# Altium schematic sheet BUS.SchDoc
size A4; SheetNumber: 8; SheetTotal: 15
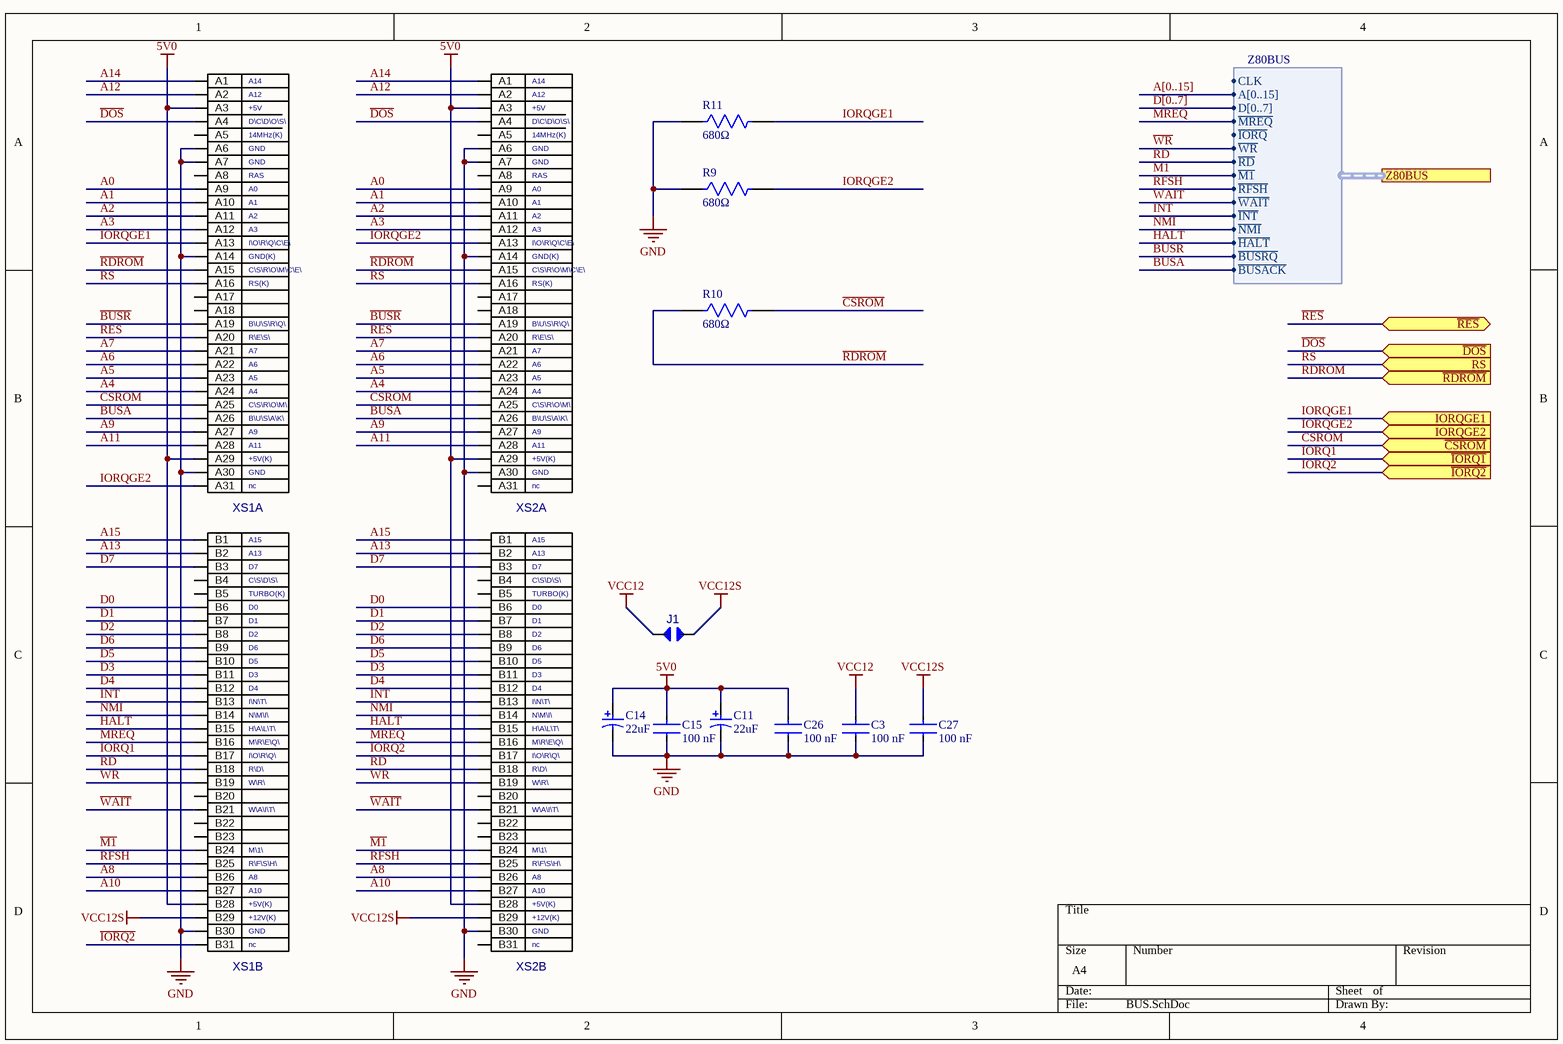
[diagram p0: BUS.SchDoc]

## Parts
C3  Capacitance: 100 nF  [FP-CC0805-0_85-IPC_A]  (hidden comment: CC0805KRX7R9BB104)
C11  Capacitance: 22uF  [AVX-TAJ-B-2_M]  (hidden comment: TAJB226K016RNJ)
C14  Capacitance: 22uF  [AVX-TAJ-B-2_M]  (hidden comment: TAJB226K016RNJ)
C15  Capacitance: 100 nF  [FP-CC0805-0_85-IPC_A]  (hidden comment: CC0805KRX7R9BB104)
C26  Capacitance: 100 nF  [FP-CC0805-0_85-IPC_A]  (hidden comment: CC0805KRX7R9BB104)
C27  Capacitance: 100 nF  [FP-CC0805-0_85-IPC_A]  (hidden comment: CC0805KRX7R9BB104)
J1  JUMPER  [JUMPER_JUMPER(Primary)]  (value not drawn)
R9  value 680Ω  [FP-RT0805-IPC_A]  (hidden comment: RT0805FRE07680RL)
R10  value 680Ω  [FP-RT0805-IPC_A]  (hidden comment: RT0805FRE07680RL)
R11  value 680Ω  [FP-RT0805-IPC_A]  (hidden comment: RT0805FRE07680RL)
XS1  ZXSLOT  [SLOT62_ZXSLOT(Primary)]  (value not drawn)  (parts A,B of 2)
XS2  ZXSLOT  [SLOT62_ZXSLOT(Primary)]  (value not drawn)  (parts A,B of 2)

## Ports
IORQGE1 (in), IORQGE2 (in), RS (in), Z80BUS (harness Z80BUS), ~{CSROM} (in), ~{DOS} (in), ~{IORQ1} (in), ~{IORQ2} (in), ~{RDROM} (in), ~{RES} (bidir)

## Harnesses
Z80BUS: A[0..15], D[0..7], ~{MREQ}, ~{IORQ}, ~{WR}, ~{RD}, ~{M1}, ~{RFSH}, ~{WAIT}, ~{INT}, ~{NMI}, ~{HALT}, ~{BUSRQ}, ~{BUSACK}, CLK

## Nets
5V0: C11.1 C14.1 C15.1 C26.1 XS1.A3 XS1.A29 XS1.B28 XS2.A3 XS2.A29 XS2.B28
GND: C3.2 C11.2 C14.2 C15.2 C26.2 C27.2 R9.1 R11.1 XS1.A6 XS1.A7 XS1.A14 XS1.A30 XS1.B30 XS2.A6 XS2.A7 XS2.A14 XS2.A30 XS2.B30
VCC12: C3.1 J1.0
VCC12S: C27.1 J1.1 XS1.B29 XS2.B29
A0: XS1.A9 XS2.A9
A1: XS1.A10 XS2.A10
A2: XS1.A11 XS2.A11
A3: XS1.A12 XS2.A12
A4: XS1.A24 XS2.A24
A5: XS1.A23 XS2.A23
A6: XS1.A22 XS2.A22
A7: XS1.A21 XS2.A21
A8: XS1.B26 XS2.B26
A9: XS1.A27 XS2.A27
A10: XS1.B27 XS2.B27
A11: XS1.A28 XS2.A28
A12: XS1.A2 XS2.A2
A13: XS1.B2 XS2.B2
A14: XS1.A1 XS2.A1
A15: XS1.B1 XS2.B1
~{BUSA}: XS1.A26 XS2.A26 ; port Z80BUS.~{BUSACK}
~{BUSR}: XS1.A19 XS2.A19 ; port Z80BUS.~{BUSRQ}
~{CSROM}: R10.2 XS1.A25 XS2.A25 ; port ~{CSROM}
D0: XS1.B6 XS2.B6
D1: XS1.B7 XS2.B7
D2: XS1.B8 XS2.B8
D3: XS1.B11 XS2.B11
D4: XS1.B12 XS2.B12
D5: XS1.B10 XS2.B10
D6: XS1.B9 XS2.B9
D7: XS1.B3 XS2.B3
~{DOS}: XS1.A4 XS2.A4 ; port ~{DOS}
~{HALT}: XS1.B15 XS2.B15 ; port Z80BUS.~{HALT}
~{INT}: XS1.B13 XS2.B13 ; port Z80BUS.~{INT}
~{IORQ1}: XS1.B17 ; port ~{IORQ1}
~{IORQ2}: XS1.B31 XS2.B17 ; port ~{IORQ2}
IORQGE1: R11.2 XS1.A13 ; port IORQGE1
IORQGE2: R9.2 XS1.A31 XS2.A13 ; port IORQGE2
~{M1}: XS1.B24 XS2.B24 ; port Z80BUS.~{M1}
~{MREQ}: XS1.B16 XS2.B16 ; port Z80BUS.~{MREQ}
~{NMI}: XS1.B14 XS2.B14 ; port Z80BUS.~{NMI}
~{RD}: XS1.B18 XS2.B18 ; port Z80BUS.~{RD}
~{RDROM}: R10.1 XS1.A15 XS2.A15 ; port ~{RDROM}
~{RES}: XS1.A20 XS2.A20 ; port ~{RES}
~{RFSH}: XS1.B25 XS2.B25 ; port Z80BUS.~{RFSH}
RS: XS1.A16 XS2.A16 ; port RS
~{WAIT}: XS1.B21 XS2.B21 ; port Z80BUS.~{WAIT}
~{WR}: XS1.B19 XS2.B19 ; port Z80BUS.~{WR}

Not connected (* = marked no-connect by the designer): XS1 A5 A8 A17 A18 B4 B5 B20 B22 B23; XS2 A5 A8 A17 A18 A31 B4 B5 B20 B22 B23 B31

## Buses and harness runs
bus A[0..15]
bus D[0..7]

## Notes on the sheet
- (in symbol ZXSLOT, part A) +5V; D\C\D\O\S\; 14MHz(K); GND; RAS; A0; I\O\R\Q\C\E\; GND(K); C\S\R\O\M\C\E\; RS(K); B\U\S\R\Q\; R\E\S\; C\S\R\O\M\; B\U\S\A\K\; +5V(K); nc
- (in symbol ZXSLOT, part B) D7; C\S\D\S\; TURBO(K); D0; D1; D2; D6; D5; D3; D4; I\N\T\; N\M\I\; H\A\L\T\; M\R\E\Q\; I\O\R\Q\; R\D\; W\R\; W\A\I\T\; M\1\; R\F\S\H\; +5V(K); +12V(K); GND; nc

## Library data of the parts
C3 C15 C26 C27 = CMP-2100-03606-3: CAP CER 0.1UF 50V X7R 0805; Manufacturer: Yageo; Value: 100 nF; Manufacturer Part Number: CC0805KRX7R9BB104; Category: Cap; Case/Package: 0805
C11 C14 = CMP-2100-03689-1: Standard Tantalum, 22 uF, +/- 10%, 16 V, -55 to 125 degC, 2-Pin SMD (1210), RoHS, Tape and Reel; Manufacturer: Kyocera AVX; value: 22uF; Number of Pins: 2; Termination: SMD/SMT; Case/Package: 1210; Manufacturer Part Number: TAJB226K016RNJ; Category: Cap
J1 = JUMPER: HLT->~IP; Value: PLS-2; Case/Package: PLS-2; Category: Connector
R9-R11 = CMP-03412-000082-1: RES SMD 680 OHM 1% 1/8W 0805; Manufacturer: Yageo; Category: Res; Manufacturer Part Number: RT0805FRE07680RL; Resistance: 680Ω; Case/Package: 0805
XS1 XS2 = ZXSLOT: Value: ZXSLOT; Case/Package: SL62; Category: Connector